# EAGLE design light-control (EAGLE 7.2.0)
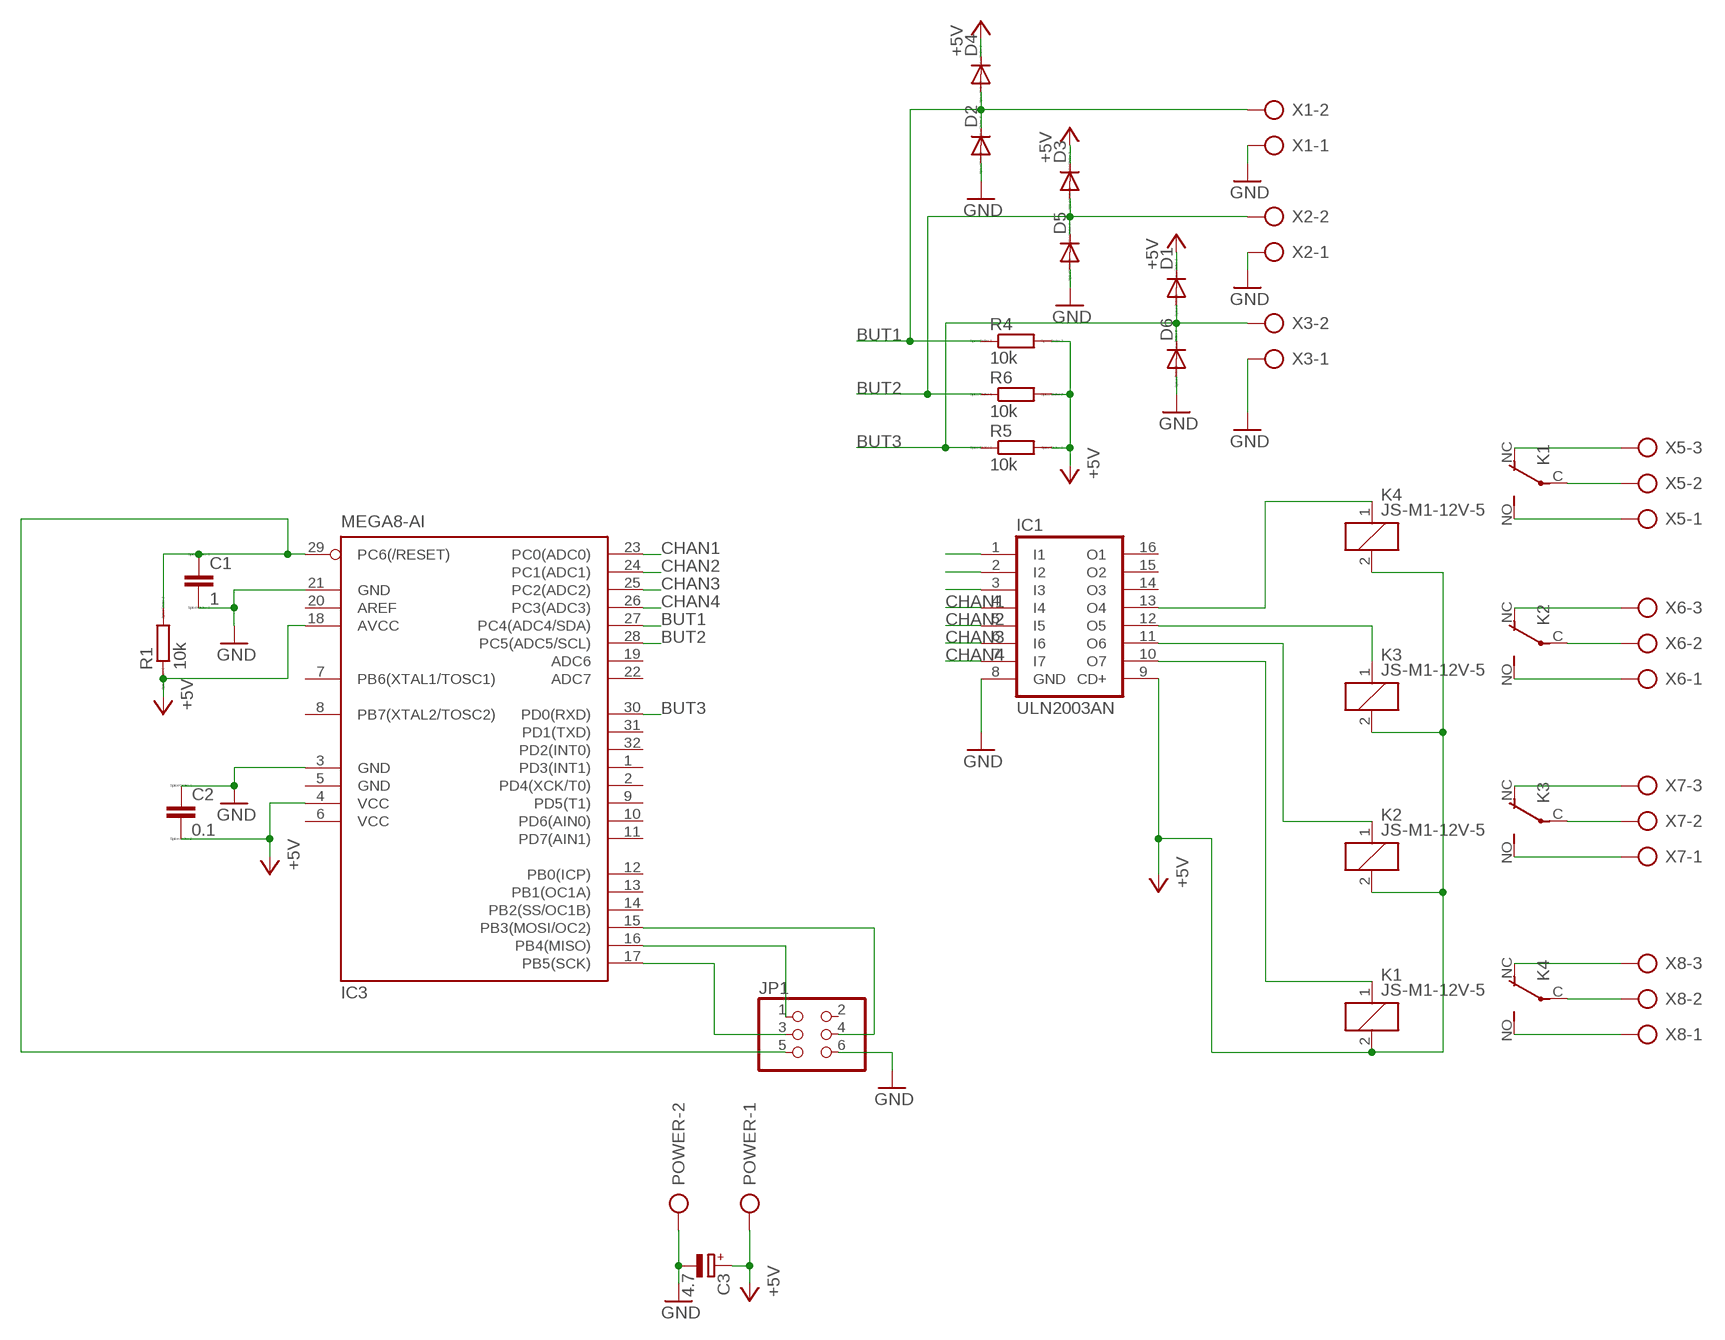
[diagram p0: schematic, sheet 1]

## Parts
C1  1  C-EUC0805  [C0805]
C2  0.1  C-EUC0805  [C0805]
C3  4.7  CPOL-EU153CLV-0605  [153CLV-0605]
D1  DIODE-SOD123  [SOD123]
D2  DIODE-SOD123  [SOD123]
D3  DIODE-SOD123  [SOD123]
D4  DIODE-SOD123  [SOD123]
D5  DIODE-SOD123  [SOD123]
D6  DIODE-SOD123  [SOD123]
IC1  ULN2003AN  [DIL16]
IC3  MEGA8-AI  [TQFP32-08]
JP1  PINHD-2X3  [2X03]
K1  JS-M1-12V-5  [JS-M]
K2  JS-M1-12V-5  [JS-M]
K3  JS-M1-12V-5  [JS-M]
K4  JS-M1-12V-5  [JS-M]
POWER  AK300/2  [AK300/2]
R1  10k  R-EU_R0805  [R0805]
R4  10k  R-EU_R0805  [R0805]
R5  10k  R-EU_R0805  [R0805]
R6  10k  R-EU_R0805  [R0805]
X1  AK300/2  [AK300/2]
X2  AK300/2  [AK300/2]
X3  AK300/2  [AK300/2]
X5  AK300/3  [AK300/3]
X6  AK300/3  [AK300/3]
X7  AK300/3  [AK300/3]
X8  AK300/3  [AK300/3]

## Nets
+5V: C2.2 C3.+ D1.C D3.C D4.C IC1.9(CD+) IC3.4(VCC) IC3.18(AVCC) K1.2 K2.2 K3.2 K4.2 POWER.1 R1.1 R4.2 R5.2 R6.2
BUT1: D2.C D4.A IC3.27(PC4(ADC4/SDA)) R4.1 X1.2
BUT2: D3.A D5.C IC3.28(PC5(ADC5/SCL)) R6.1 X2.2
BUT3: D1.A D6.C IC3.30(PD0(RXD)) R5.1 X3.2
CHAN1: IC1.4(I4) IC3.23(PC0(ADC0))
CHAN2: IC1.5(I5) IC3.24(PC1(ADC1))
CHAN3: IC1.6(I6) IC3.25(PC2(ADC2))
CHAN4: IC1.7(I7) IC3.26(PC3(ADC3))
GND: C1.2 C2.1 C3.- D2.A D5.A D6.A IC1.8(GND) IC3.3(GND) IC3.21(GND) JP1.6 POWER.2 X1.1 X2.1 X3.1
N$1: IC1.1(I1)
N$2: IC3.16(PB4(MISO)) JP1.1
N$3: IC3.17(PB5(SCK)) JP1.3
N$4: IC3.15(PB3(MOSI/OC2)) JP1.4
N$5: C1.1 IC3.29(PC6(/RESET)) JP1.5 R1.2
N$6: IC1.2(I2)
N$7: IC1.3(I3)
N$8: IC1.10(O7) K1.1
N$9: K1.C(2:P) X5.2
N$10: IC1.11(O6) K2.1
N$11: IC1.12(O5) K3.1
N$12: IC1.13(O4) K4.1
N$14: K1.NO(2:S) X5.1
N$15: K2.C(2:P) X6.2
N$16: K2.NO(2:S) X6.1
N$17: K3.C(2:P) X7.2
N$18: K3.NO(2:S) X7.1
N$19: K4.C(2:P) X8.2
N$20: K4.NO(2:S) X8.1
N$24: K1.NC(2:O) X5.3
N$25: K2.NC(2:O) X6.3
N$26: K3.NC(2:O) X7.3
N$27: K4.NC(2:O) X8.3
Unconnected: IC1.14(O3) IC1.15(O2) IC1.16(O1) IC3.1(PD3(INT1)) IC3.2(PD4(XCK/T0)) IC3.7(PB6(XTAL1/TOSC1)) IC3.8(PB7(XTAL2/TOSC2)) IC3.9(PD5(T1)) IC3.10(PD6(AIN0)) IC3.11(PD7(AIN1)) IC3.12(PB0(ICP)) IC3.13(PB1(OC1A)) IC3.14(PB2(SS/OC1B)) IC3.19(ADC6) IC3.20(AREF) IC3.22(ADC7) IC3.31(PD1(TXD)) IC3.32(PD2(INT0)) JP1.2

## Power pins joined to a net without a drawn wire
GND: IC3.5(GND)
VCC: IC3.6(VCC)

## Library data of the parts
C1 C2 = resistor:C-EU: CAPACITOR, European symbol; SPICEPREFIX: C
C3 = resistor:CPOL-EU: POLARIZED CAPACITOR, European symbol
D1-D6 = diode:DIODE-: DIODE
IC1 = uln-udn:ULN2003A: DRIVER ARRAY
IC3 = atmel:MEGA8: MICROCONTROLLER 8 Kbytes FLASH, 1 kbytes SRAM, 512 bytes EEPROM, USART, 6-channel 10 bit ADC, 2-channel 8 bit ADC Pin compatible with Atmega48, ATMega88, ATMega168 Source: avr.lbr; MPN: ATMEGA8-16AU; OC_FARNELL: 9171371; OC_NEWARK: 73M8863
JP1 = pinhead:PINHD-2X3: PIN HEADER
K1-K4 = relay:JS-M1*: Automotive Ultra-Miniature Power Relay NAiS Source: http://www.mew-europe.com/.. en_ds_61211_0000.pdf; MF: FARNELL; MPN: JSM1-12V-5; OC_FARNELL: 910351; OC_NEWARK: 14J1764
POWER X1-X3 = con-ptr500:AK300/2: CONNECTOR; OC_FARNELL: unknown; OC_NEWARK: unknown
R1 R4-R6 = resistor:R-EU_: RESISTOR, European symbol; SPICEPREFIX: R
X5-X8 = con-ptr500:AK300/3: CONNECTOR; OC_FARNELL: unknown; OC_NEWARK: unknown

## Board
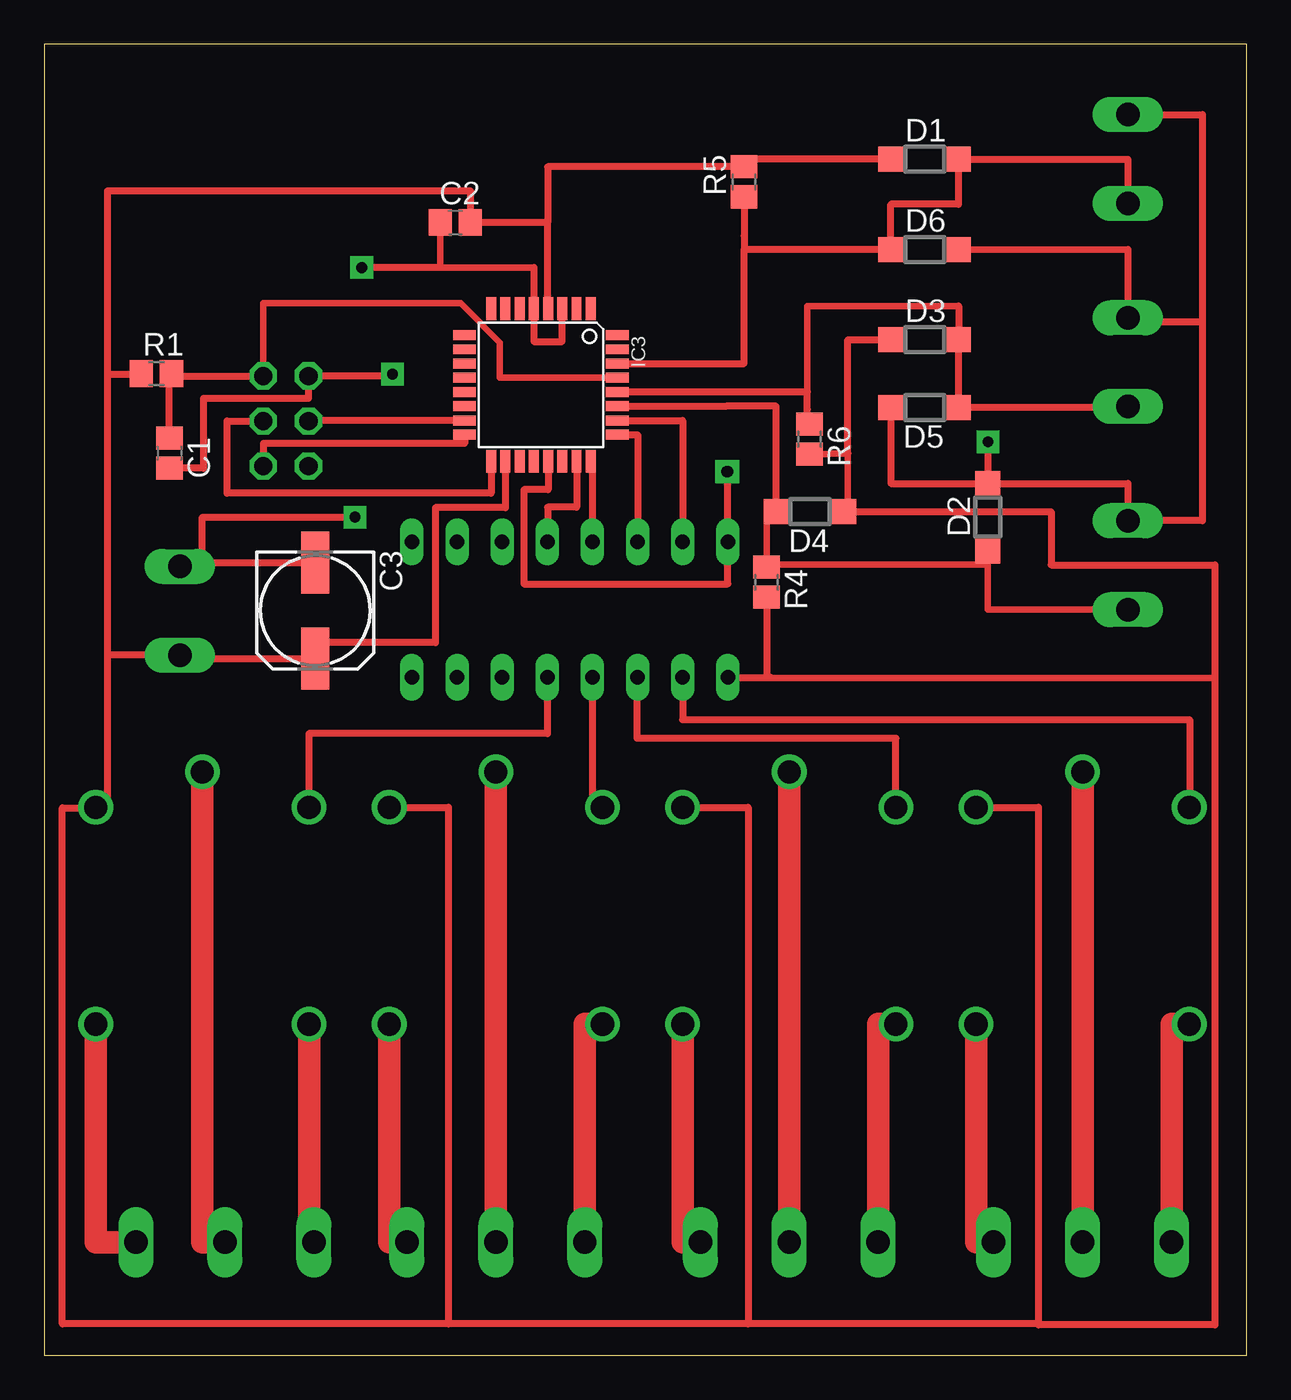
[diagram p1: board, top side]
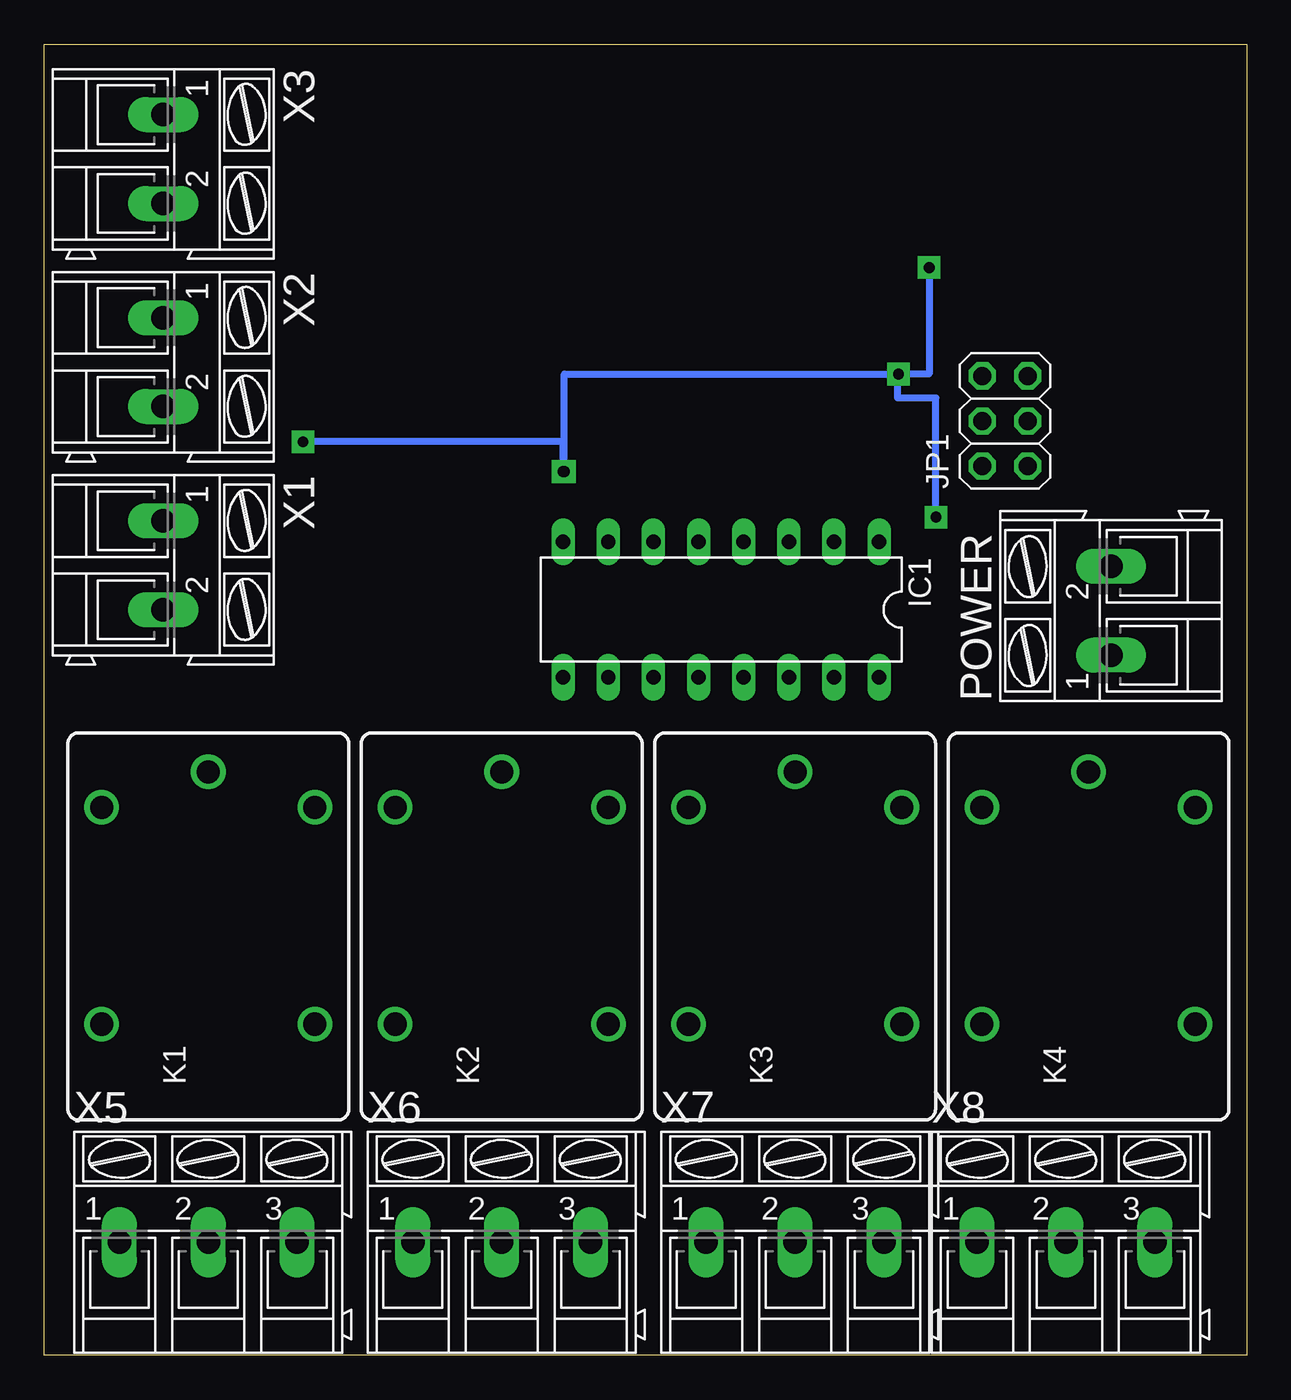
[diagram p2: board, bottom side, seen from below]

Size 67.64 x 73.78 mm. Coordinates in mm from the lower left corner, seen from the top.
Outline: 0,0 67.64,0 67.64,73.78 0,73.78 0,0
Copper layers (1*16): Top 0.035mm / dielectric 1.5mm / Bottom 0.035mm
Design rules "default": minimum track width 10mil, minimum drill 24mil, track to track 8mil, track to pad 8mil, pad to pad 8mil, via to via 8mil, smd to smd 8mil, copper to edge 40mil, drill to drill 8mil, minimum pad ring 10mil, minimum via ring 8mil, stop-mask expansion 4mil, vias tented up to drill 0mil, thermal gap 10mil

### Footprints (pad centres in the part's own frame; a part is rotated, then mirrored left to right if it is on the bottom)
C0805 = smd 1.3 x 1.5: 1 -0.85,0; 2 0.85,0
153CLV-0605 = smd 3.5 x 1.6: + 2.7,0; - -2.7,0
SOD123 = smd 1.4 x 1.4: A 1.9,0; C -1.9,0
DIL16 = drill 0.813 long: 1 -8.89,-3.81; 2 -6.35,-3.81; 3 -3.81,-3.81; 4 -1.27,-3.81; 5 1.27,-3.81; 6 3.81,-3.81; 7 6.35,-3.81; 8 8.89,-3.81; 9 8.89,3.81; 10 6.35,3.81; 11 3.81,3.81; 12 1.27,3.81; 13 -1.27,3.81; 14 -3.81,3.81; 15 -6.35,3.81; 16 -8.89,3.81
TQFP32-08 = smd 1.27 x 0.559: 1 -4.293,2.8; 2 -4.293,2; 3 -4.293,1.2; 4 -4.293,0.4; 5 -4.293,-0.4; 6 -4.293,-1.2; 7 -4.293,-2; 8 -4.293,-2.8; 17 4.293,-2.8; 18 4.293,-2; 19 4.293,-1.2; 20 4.293,-0.4; 21 4.293,0.4; 22 4.293,1.2; 23 4.293,2; 24 4.293,2.8 | smd 0.559 x 1.27: 9 -2.8,-4.293; 10 -2,-4.293; 11 -1.2,-4.293; 12 -0.4,-4.293; 13 0.4,-4.293; 14 1.2,-4.293; 15 2,-4.293; 16 2.8,-4.293; 25 2.8,4.293; 26 2,4.293; 27 1.2,4.293; 28 0.4,4.293; 29 -0.4,4.293; 30 -1.2,4.293; 31 -2,4.293; 32 -2.8,4.293
2X03 = drill 1.016 octagon: 1 -2.54,-1.27; 2 -2.54,1.27; 3 0,-1.27; 4 0,1.27; 5 2.54,-1.27; 6 2.54,1.27
JS-M = drill 1.3: 1 6.7,6; 2 6.7,-6; C 8.7,0; NC -5.5,-6; NO -5.5,6
AK300/2 = drill 1.321 long: 1 -2.515,0; 2 2.489,0
R0805 = smd 1.3 x 1.5: 1 -0.85,0; 2 0.85,0
AK300/3 = drill 1.321 long: 1 -5.004,0; 2 0,0; 3 5.004,0

### Placement (x,y rotation side)
C1  7.04,50.77 270 top
C2  23.11,63.75 0 top
C3  15.24,41.91 270 top
D1  49.53,67.31 0 top
D2  53.09,47.17 90 top
D3  49.53,57.15 0 top
D4  43.08,47.47 180 top
D5  49.53,53.34 180 top
D6  49.53,62.23 0 top
IC1  29.57,41.96 180 bottom
IC3  27.94,54.61 270 top
JP1  13.59,52.58 90 bottom
K1  58.42,24.13 90 bottom
K2  41.91,24.13 90 bottom
K3  25.4,24.13 90 bottom
K4  8.89,24.13 90 bottom
POWER  7.62,41.91 90 bottom
R1  6.3,55.24 0 top
R4  40.64,43.51 270 top
R5  39.37,66.04 90 top
R6  43.05,51.56 270 top
X1  60.96,44.45 270 bottom
X2  60.96,55.88 270 bottom
X3  60.96,67.31 270 bottom
X5  58.42,6.35 0 bottom
X6  41.91,6.35 0 bottom
X7  25.4,6.35 0 bottom
X8  10.16,6.35 0 bottom

### Tracks (layer width: path | path; a pad name or v marks a point on that pad's centre or on a via)
+5V
  Top 0.356: D4.C 45.21,47.47 45.21,50.76
  Top 0.406: 15.24,39.42 C3.+ | C3.+ 7.62,39.21 POWER.1 3.56,39.4 | D3.C 45.21,57.15 45.21,50.76 R6.2 | D1.C 39.37,67.31 R5.2 28.32,66.89 28.32,63.75 | IC3.4 28.32,58.9 28.32,63.75 | 28.32,63.75 C2.2 23.96,65.53 3.56,65.53 3.56,55.19 | 3.56,39.4 3.56,55.19 | R1.1 5.45,55.19 3.56,55.19 | 3.56,39.4 3.56,30.83 K4.2 2.89,30.81 1.02,30.81 1.02,1.75 22.73,1.75 | K1.2 55.93,30.83 55.93,1.75 | 55.93,1.75 39.6,1.75 | 39.6,1.75 22.73,1.75 | K3.2 22.73,30.83 22.73,1.75 | K2.2 39.6,30.83 39.6,1.75 | IC1.9 40.87,38.15 | 40.87,38.15 65.86,38.1 | 65.86,38.1 65.86,1.7 55.93,1.7 55.93,1.75 | D4.C 56.64,47.47 56.64,44.48 65.86,44.48 65.86,38.1 | 15.24,40.69 15.24,40.11 | 15.24,40.11 C3.+ | R4.2 40.64,38.15 40.87,38.15 | IC3.18 25.94,47.7 22,47.7 22,40.11 15.24,40.11
BUT1
  Top 0.356: D2.C 53.09,44.5 | 53.09,44.5 53.09,41.96 X1.2 | R4.1 40.64,44.5 | 40.64,44.5 53.09,44.5 | 40.64,44.5 40.64,47.47 D4.A
  Top 0.406: IC3.27 37.85,53.41 38.35,53.41 41.18,53.41 D4.A 41.22,47.47
BUT2
  Top 0.356: 51.44,59.05 42.93,59.05 42.93,53.24
  Top 0.406: X2.2 60.96,53.34 D5.C D3.A 51.44,59.05 | IC3.28 32.23,54.23 42.93,54.23 42.93,53.24 42.93,52.41 R6.1
BUT3
  Top 0.406: R5.1 39.37,62.99 39.37,62.23 | X3.2 60.96,67.31 D1.A 51.43,64.77 47.63,64.77 D6.C 39.37,62.23 | IC3.30 39.37,55.81 39.37,62.23
CHAN1
  Top 0.406: IC3.23 29.94,47.73 28.32,47.73 28.32,45.77 IC1.4
CHAN2
  Top 0.406: IC3.24 30.84,50.32 IC1.5
CHAN3
  Top 0.406: IC3.25 33.38,51.81 IC1.6
CHAN4
  Top 0.406: IC3.26 35.92,52.61 IC1.7
GND  (via drill 0.6 pad 1.27)
  Top 0.356: C2.1 22.26,61.21 27.54,61.21 | D6.A 60.96,62.23 X2.1
  Top 0.406: POWER.2 7.62,44.61 8.89,44.61 | 8.89,44.61 C3.- | 27.54,61.21 IC3.5 27.54,57.05 29.13,57.05 IC3.3 | C1.2 8.94,49.92 8.94,53.85 14.86,53.85 JP1.6 19.58,55.12 v19.58,55.22 | 8.89,44.61 8.89,47.17 v17.48,47.17 | 22.26,61.21 v17.86,61.21 | X3.1 65.15,69.83 65.15,58.17 | 65.15,58.17 65.15,46.97 X1.1 60.96,49.07 D2.A | D5.A 47.63,49.07 D2.A | 60.96,62.23 60.96,58.17 65.15,58.17 | IC3.21 28.34,48.72 26.98,48.72 26.98,43.41 38.46,43.41 IC1.8 v38.46,49.73 v38.38,49.73 | v53.09,51.41 D2.A
  Bottom 0.406: v17.48,47.17 17.48,53.87 19.63,53.87 19.63,55.22 v19.58,55.22 | v17.86,61.21 17.86,55.22 v19.58,55.22 | v38.38,49.73 38.38,55.22 v19.58,55.22 | v38.46,49.73 38.46,51.41 v53.09,51.41
N$2
  Top 0.406: IC3.16 23.65,51.31 12.32,51.31 JP1.1
N$3
  Top 0.406: IC3.17 25.14,48.51 10.29,48.51 10.29,52.58 JP1.3
N$4
  Top 0.406: IC3.15 14.86,52.61 JP1.4
N$5
  Top 0.356: IC3.29 25.63,55.01 25.63,57 23.42,59.21 12.32,59.21 JP1.5
  Top 0.406: R1.2 7.15,55.12 | 7.15,55.12 JP1.5 | C1.1 7.04,55.12 7.15,55.12
N$8
  Top 0.406: IC1.10 35.92,35.76 64.44,35.76 64.44,30.83 K1.1
N$9
  Top 1.27: X5.2 K1.C
N$10
  Top 0.406: K2.1 47.91,34.72 33.35,34.72 33.35,38.15 IC1.11
N$11
  Top 0.406: IC1.12 30.84,30.83 K3.1
N$12
  Top 0.406: IC1.13 28.3,34.98 14.88,34.98 K4.1
N$14
  Top 1.27: X5.1 63.42,18.63 K1.NO
N$15
  Top 1.27: X6.2 K2.C
N$16
  Top 1.27: X6.1 46.91,18.63 K2.NO
N$17
  Top 1.27: X7.2 K3.C
N$18
  Top 1.27: X7.1 30.4,18.63 K3.NO
N$19
  Top 1.27: X8.2 8.89,6.35 K4.C
N$20
  Top 1.27: X8.1 14.89,6.35 K4.NO
N$24
  Top 1.27: K1.NC 52.42,6.35 X5.3
N$25
  Top 1.27: K2.NC 35.91,6.35 X6.3
N$26
  Top 1.27: K3.NC 19.4,6.35 X7.3
N$27
  Top 1.27: K4.NC 2.89,6.35 X8.3